# Altium schematic sheet connectors.SchDoc
size A4; PageSetup: Record=PageOptions|CenterHorizontal=True|CenterVertical=True|PrintScale=1.00|XCorrection=1.00|YCorrection=1.00|PrintKind=1|BorderSize=5000000|LeftOffset=0|BottomOffset=0|Orientation=2|PaperLength=1000|PaperWidth=1000|Scale=100|PaperSource=7|PrintQuality=600|MediaType=1|DitherType=10|PrintScaleMode=1|PaperKind=A4|PaperIndex=9
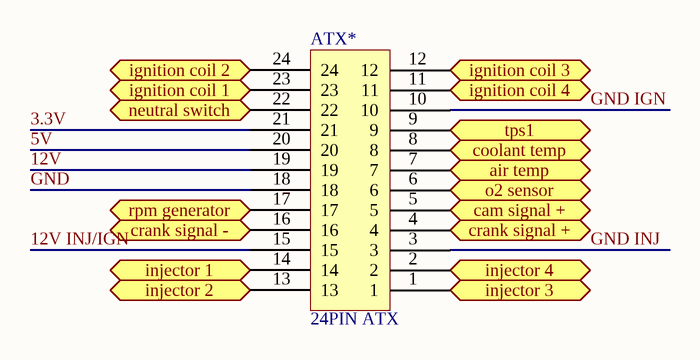
[diagram p0: connectors.SchDoc]

## Parts
ATX*  24PIN ATX  [24 PIN ATX]

## Ports
air temp (bidir), cam signal + (bidir), coolant temp (bidir), crank signal + (bidir), crank signal - (bidir), ignition coil 1 (bidir), ignition coil 2 (bidir), ignition coil 3 (bidir), ignition coil 4 (bidir), injector 1 (bidir), injector 2 (bidir), injector 3 (bidir), injector 4 (bidir), neutral switch (bidir), o2 sensor (bidir), rpm generator (bidir), tps1 (bidir)

## Nets
3.3V: ATX*.21
5V: ATX*.20
12V: ATX*.19
12V INJ/IGN: ATX*.15
air temp: ATX*.7 ; port air temp
cam signal +: ATX*.5 ; port cam signal +
coolant temp: ATX*.8 ; port coolant temp
crank signal +: ATX*.4 ; port crank signal +
crank signal -: ATX*.16 ; port crank signal -
GND: ATX*.18
GND IGN: ATX*.10
GND INJ: ATX*.3
ignition coil 1: ATX*.23 ; port ignition coil 1
ignition coil 2: ATX*.24 ; port ignition coil 2
ignition coil 3: ATX*.12 ; port ignition coil 3
ignition coil 4: ATX*.11 ; port ignition coil 4
injector 1: ATX*.14 ; port injector 1
injector 2: ATX*.13 ; port injector 2
injector 3: ATX*.1 ; port injector 3
injector 4: ATX*.2 ; port injector 4
neutral switch: ATX*.22 ; port neutral switch
o2 sensor: ATX*.6 ; port o2 sensor
rpm generator: ATX*.17 ; port rpm generator
tps1: ATX*.9 ; port tps1